# Altium schematic sheet Switch.SchDoc
size A4
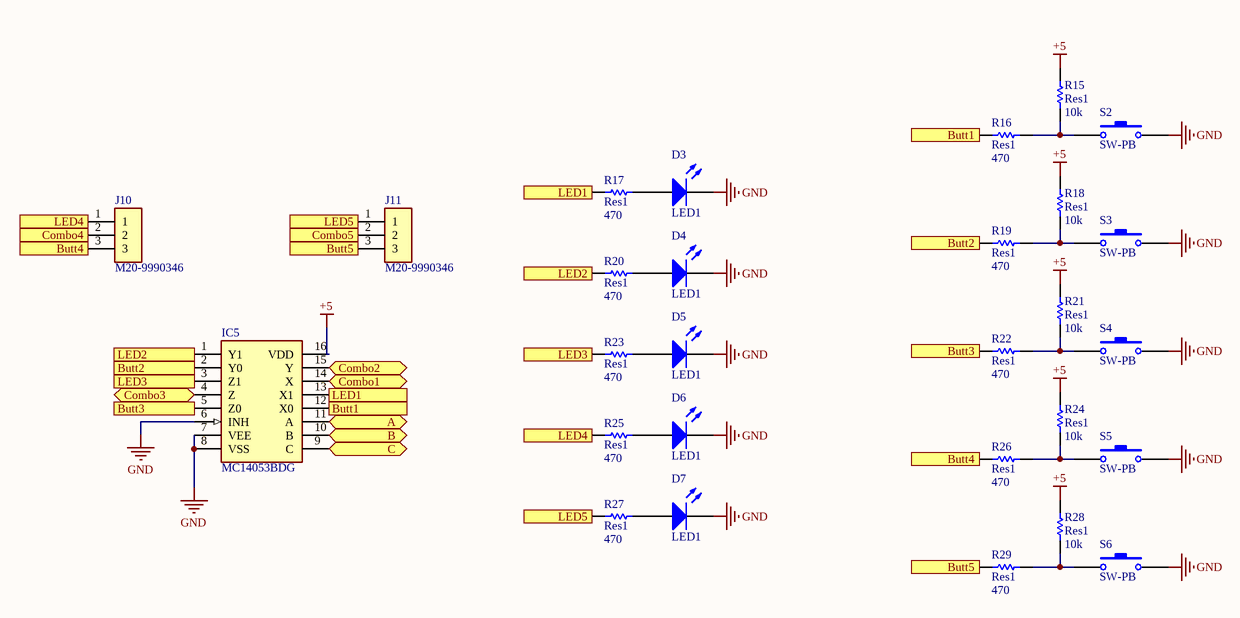
[diagram p0: Switch.SchDoc]

## Parts
D3  LED1  [LED 3mm]
D4  LED1  [LED 3mm]
D5  LED1  [LED 3mm]
D6  LED1  [LED 3mm]
D7  LED1  [LED 3mm]
IC5  MC14053BDG  [Triple SPDT switch]
J10  M20-9990346  [header 3 pins male]
J11  M20-9990346  [header 3 pins male]
R15  Res1  value 10k  [Resistor 1210]
R16  Res1  value 470  [Resistor 1210]
R17  Res1  value 470  [Resistor 1210]
R18  Res1  value 10k  [Resistor 1210]
R19  Res1  value 470  [Resistor 1210]
R20  Res1  value 470  [Resistor 1210]
R21  Res1  value 10k  [Resistor 1210]
R22  Res1  value 470  [Resistor 1210]
R23  Res1  value 470  [Resistor 1210]
R24  Res1  value 10k  [Resistor 1210]
R25  Res1  value 470  [Resistor 1210]
R26  Res1  value 470  [Resistor 1210]
R27  Res1  value 470  [Resistor 1210]
R28  Res1  value 10k  [Resistor 1210]
R29  Res1  value 470  [Resistor 1210]
S2  SW-PB  [Button]
S3  SW-PB  [Button]
S4  SW-PB  [Button]
S5  SW-PB  [Button]
S6  SW-PB  [Button]

## Ports
A (bidir), B (bidir), Butt1 (in), Butt1 (out), Butt2 (in), Butt2 (out), Butt3 (in), Butt3 (out), Butt4 (in), Butt4 (out), Butt5 (in), Butt5 (out), C (bidir), Combo1 (bidir), Combo2 (bidir), Combo3 (bidir), Combo4, Combo5, LED1 (in), LED1 (out), LED2 (in), LED2 (out), LED3 (in), LED3 (out), LED4 (in), LED4 (out), LED5 (in), LED5 (out)

## Nets
+5: IC5.16(VDD) R15.2 R18.2 R21.2 R24.2 R28.2
GND: D3.2(K) D4.2(K) D5.2(K) D6.2(K) D7.2(K) IC5.6(INH) IC5.7(VEE) IC5.8(VSS) S2.2 S3.2 S4.2 S5.2 S6.2
A: IC5.11(A) ; port A
B: IC5.10(B) ; port B
Butt1: IC5.12(X0) R16.1 ; port Butt1
Butt2: IC5.2(Y0) R19.1 ; port Butt2
Butt3: IC5.5(Z0) R22.1 ; port Butt3
Butt4: J10.3 R26.1 ; port Butt4
Butt5: J11.3 R29.1 ; port Butt5
C: IC5.9(C) ; port C
Combo1: IC5.14(X) ; port Combo1
Combo2: IC5.15(Y) ; port Combo2
Combo3: IC5.4(Z) ; port Combo3
Combo4: J10.2 ; port Combo4
Combo5: J11.2 ; port Combo5
LED1: IC5.13(X1) R17.2 ; port LED1
LED2: IC5.1(Y1) R20.2 ; port LED2
LED3: IC5.3(Z1) R23.2 ; port LED3
LED4: J10.1 R25.2 ; port LED4
LED5: J11.1 R27.2 ; port LED5
NetD3_1: D3.1(A) R17.1
NetD4_1: D4.1(A) R20.1
NetD5_1: D5.1(A) R23.1
NetD6_1: D6.1(A) R25.1
NetD7_1: D7.1(A) R27.1
NetR15_1: R15.1 R16.2 S2.1
NetR18_1: R18.1 R19.2 S3.1
NetR21_1: R21.1 R22.2 S4.1
NetR24_1: R24.1 R26.2 S5.1
NetR28_1: R28.1 R29.2 S6.1

## Library data of the parts
D3-D7 = LED1: Typical RED GaAs LED; Published: 8-Jun-2000; LatestRevisionDate: 08-Jul-2005; LatestRevisionNote: Mech Layer 1 removed.; PackageReference: LED-1; Publisher: Altium Limited; PackageDescription: LED; 2 Leads
IC5 = MC14053BDG: Integrated Circuit; Manufacturer_Name: ON Semiconductor; Datasheet Link: http://www.onsemi.com/pub/Collateral/MC14051B-D.PDF; Height: 1.75mm; Manufacturer_Part_Number: MC14053BDG; Arrow Part Number: MC14053BDG; Arrow Price/Stock: https://www.arrow.com/en/products/mc14053bdg/on-semiconductor; Mouser Part Number: 863-MC14053BDG; Mouser Price/Stock: https://www.mouser.co.uk/ProductDetail/ON-Semiconductor/MC14053BDG?qs=g2rIOKKlpobK7Wa1TqI4Yg%3D%3D
J10 J11 = M20-9990346: Connector; Manufacturer_Name: Harwin; Datasheet Link: http://uk.rs-online.com/web/p/products/7457068; Height: 8.64mm; Manufacturer_Part_Number: M20-9990346; Mouser Part Number: 855-M20-9990346; Mouser Price/Stock: https://www.mouser.co.uk/ProductDetail/Harwin/M20-9990346?qs=ulE8k0yEMYbyhQ3uXpFs8Q%3D%3D
R15-R29 = Res1: Resistor; Published: 8-Jun-2000; LatestRevisionDate: 17-Jul-2002; LatestRevisionNote: Re-released for DXP Platform.; PackageReference: AXIAL-0.3; Publisher: Altium Limited; PackageDescription: Axial Device, Thru-Hole; 2 Leads; 0.3 in Pin Spacing
S2-S6 = SW-PB: Switch; Published: 24-Mar-1999; LatestRevisionDate: 17-Jul-2002; LatestRevisionNote: Re-released for DXP Platform.; PackageReference: SPST-2; Publisher: Altium Limited; PackageDescription: Switch; 2 Leads